# Altium schematic sheet MCU.SchDoc
size A4
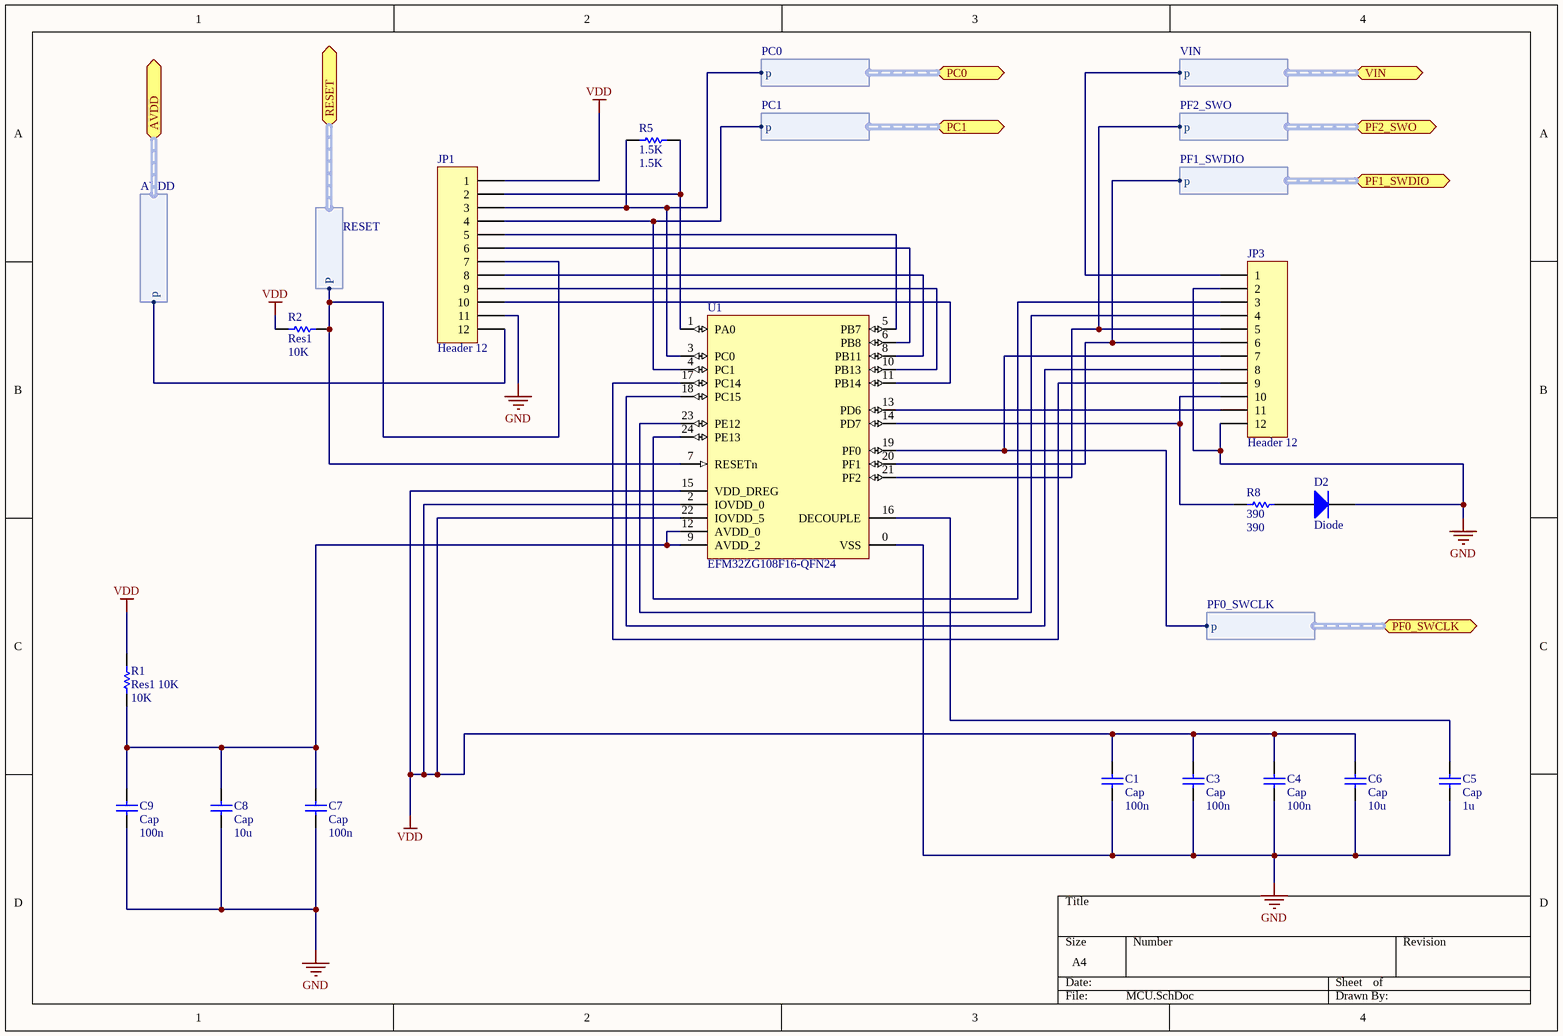
[diagram p0: MCU.SchDoc]

## Parts
C1  Cap  value 100n  [RAD-0.3]
C3  Cap  value 100n  [RAD-0.3]
C4  Cap  value 100n  [RAD-0.3]
C5  Cap  value 1u  [RAD-0.3]
C6  Cap  value 10u  [RAD-0.3]
C7  Cap  value 100n  [RAD-0.3]
C8  Cap  value 10u  [RAD-0.3]
C9  Cap  value 100n  [RAD-0.3]
D2  Diode  [SMC]
JP1  Header 12  [HDR1X12]
JP3  Header 12  [HDR1X12]
R1  Res1 10K  value 10K  [AXIAL-0.3]
R2  Res1  value 10K  [AXIAL-0.3]
R5  1.5K  [AXIAL-0.3]
R8  390  [AXIAL-0.3]
U1  EFM32ZG108F16-QFN24  [ENMR-QFN24_M]

## Ports
AVDD (harness AVDD), PC0 (harness PC0), PC1 (harness PC1), PF0_SWCLK (harness PF0_SWCLK), PF1_SWDIO (harness PF1_SWDIO), PF2_SWO (harness PF2_SWO), RESET (harness RESET), VIN (harness VIN)

## Harnesses
RESET: P
AVDD: p
PF0_SWCLK: p
VIN: p
PF2_SWO: p
PF1_SWDIO: p
PC0: p
PC1: p

## Nets
GND: C1.1 C3.1 C4.1 C5.1 C6.1 C7.1 C8.1 C9.1 D2.2(K) JP1.11 JP3.2 JP3.12 U1.0(VSS)
VDD: C1.2 C3.2 C4.2 C6.2 JP1.1 R1.2 R2.2 U1.2(IOVDD_0) U1.15(VDD_DREG) U1.22(IOVDD_5)
NetC5_2: C5.2 U1.16(DECOUPLE)
NetC7_2: C7.2 C8.2 C9.2 R1.1 U1.9(AVDD_2) U1.12(AVDD_0)
NetD2_1: D2.1(A) R8.2
NetJP1_2: JP1.2 R5.2 U1.1(PA0)
NetJP1_3: JP1.3 R5.1 U1.3(PC0) ; port PC0.p
NetJP1_4: JP1.4 U1.4(PC1) ; port PC1.p
NetJP1_5: JP1.5 U1.5(PB7)
NetJP1_6: JP1.6 U1.6(PB8)
NetJP1_7: JP1.7 R2.1 U1.7(RESETn) ; port RESET.P
NetJP1_8: JP1.8 U1.8(PB11)
NetJP1_9: JP1.9 U1.10(PB13)
NetJP1_10: JP1.10 U1.11(PB14)
NetJP1_12: JP1.12 ; port AVDD.p
NetJP3_1: JP3.1 ; port VIN.p
NetJP3_3: JP3.3 U1.24(PE13)
NetJP3_4: JP3.4 U1.23(PE12)
NetJP3_5: JP3.5 U1.21(PF2) ; port PF2_SWO.p
NetJP3_6: JP3.6 U1.20(PF1) ; port PF1_SWDIO.p
NetJP3_7: JP3.7 U1.19(PF0) ; port PF0_SWCLK.p
NetJP3_8: JP3.8 U1.18(PC15)
NetJP3_9: JP3.9 U1.17(PC14)
NetJP3_10: JP3.10 R8.1 U1.14(PD7)
NetJP3_11: JP3.11 U1.13(PD6)

## Library data of the parts
C1 C3-C9 = Cap: Capacitor; Published: 8-Jun-2000; LatestRevisionDate: 17-Jul-2002; LatestRevisionNote: Re-released for DXP Platform.; PackageReference: RAD-0.3; Publisher: Altium Limited; PackageDescription: Radial Cap, Thru-Hole; 2 Leads; 0.3 in Pin Spacing
D2 = Diode: Default Diode; Published: 8-Jun-2000; LatestRevisionDate: 17-Jul-2002; LatestRevisionNote: Re-released for DXP Platform.; PackageVersion: Sep-1996; PackageReference: SMC; Publisher: Altium Limited; PackageDescription: DO-214-AB/SMC; 2 C-Bend Leads; Body 7.9 x 5.9 mm, inc. leads (LxW); Code_JEDEC: DO-214-AB
JP1 JP3 = Header 12: Header, 12-Pin; LatestRevisionDate: 17-Jul-2002; LatestRevisionNote: Re-released for DXP Platform.; Publisher: Altium Limited
R1 R2 R5 R8 = Res1: Resistor; Published: 8-Jun-2000; LatestRevisionDate: 17-Jul-2002; LatestRevisionNote: Re-released for DXP Platform.; PackageReference: AXIAL-0.3; Publisher: Altium Limited; PackageDescription: Axial Device, Thru-Hole; 2 Leads; 0.3 in Pin Spacing
  R5: Value: 1.5K
  R8: Value: 390
U1 = CMP-0270-00117-1: EFM32 Zero Gecko, M0+ ARM Cortex CPU, 16 KB Flash, 4 KB RAM, 1.85 - 3.8 V Supply, 32 MHz Max Speed, -40 to 85 degC, 24-Pin QFN, RoHS Compliant; Flash (KB): 16; RAM (KB): 4; GPIO: 17; USART/SPI (I2S): 1 (1); I2C: 1; Max Speed (MHz): 32; ComponentLink3Description: Package Specification; Subcategory: EFM32 Zero Gecko; PackageDescription: 24-Pin Quad Flat No-lead Package, Body 5.0 x 5.0 mm, Pitch 0.65 mm; PackageReference: QFN24; Mounting Technology: Surface Mount; Supply Voltage (V): 1.85 - 3.8; DatasheetVersion: Rev 0.40; ComponentLink1Description: Manufacturer URL; ComponentLink1URL: http://www.energymicro.com/; PartNumber: EFM32ZG108F16-QFN24; ARM Cortex CPU: M0+; ComponentLink2Description: Datasheet; PackageVersion: Rev. 98SPP24076A_XO2_25MAR2011; ComponentLink2URL: http://cdn.energymicro.com/dl/devices/pdf/d0063_efm32zg108_datasheet.pdf; Generic Part Number: EFM32ZG108; ComponentLink3URL: http://cdn.energymicro.com/dl/devices/pdf/d0032_efm32tg108_datasheet.pdf